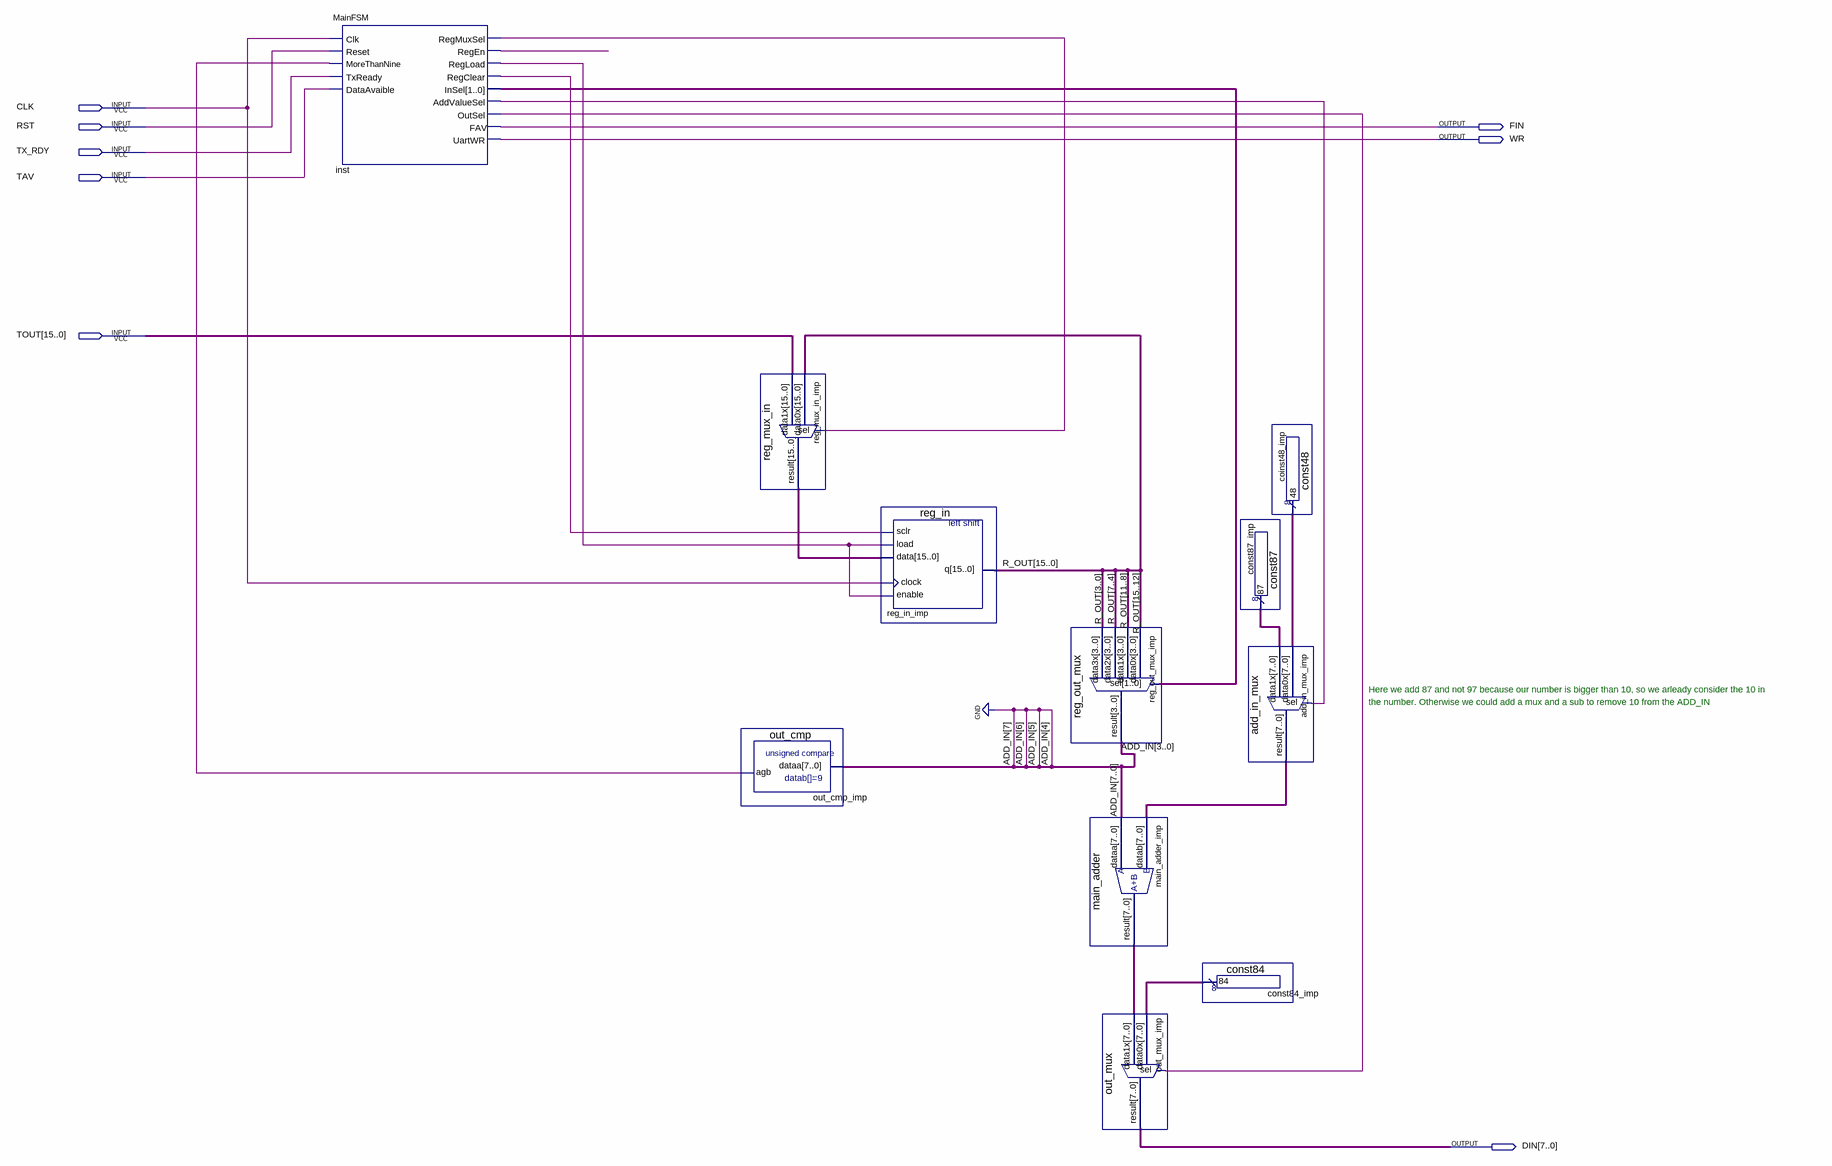
[diagram p0: schematic sheet]
// Quartus schematic ASCIIConverter.bdf as structural Verilog: 11 symbols, 8 pins
module ASCIIConverter (
  input  CLK,
  input  RST,
  input  TX_RDY,
  input  TAV,
  input  [15:0] TOUT,
  output FIN,
  output WR,
  output [7:0] DIN
);

  wire inst_addvaluesel, inst_outsel, inst_regclear, inst_regen, inst_regload, inst_regmuxsel,
       out_cmp_imp_agb;
  wire [1:0] inst_insel;
  wire [3:0] ADD_IN;
  wire [7:0] add_in_mux_imp_result, coinst48_imp_result, const84_imp_result, const87_imp_result,
       main_adder_imp_result;
  wire [15:0] R_OUT, reg_mux_in_imp_result;

  MainFSM inst (
    .Clk(CLK), .Reset(RST), .MoreThanNine(out_cmp_imp_agb), .TxReady(TX_RDY), .DataAvaible(TAV),
    .RegMuxSel(inst_regmuxsel), .RegEn(inst_regen), .RegLoad(inst_regload), .RegClear(inst_regclear),
    .InSel(inst_insel), .AddValueSel(inst_addvaluesel), .OutSel(inst_outsel), .FAV(FIN), .UartWR(WR));
  reg_mux_in reg_mux_in_imp (.data1x(TOUT), .data0x(R_OUT), .sel(inst_regmuxsel), .result(reg_mux_in_imp_result));
  out_cmp out_cmp_imp (.dataa({4'b0000, ADD_IN}), .agb(out_cmp_imp_agb));
  reg_in reg_in_imp (
    .sclr(inst_regclear), .load(inst_regload), .data(reg_mux_in_imp_result), .clock(CLK),
    .enable(inst_regload), .q(R_OUT));
  reg_out_mux reg_out_mux_imp (
    .data3x(R_OUT[3:0]), .data2x(R_OUT[7:4]), .data1x(R_OUT[11:8]), .data0x(R_OUT[15:12]), .sel(inst_insel),
    .result(ADD_IN));
  main_adder main_adder_imp (.dataa({4'b0000, ADD_IN}), .datab(add_in_mux_imp_result), .result(main_adder_imp_result));
  out_mux out_mux_imp (.data1x(main_adder_imp_result), .data0x(const84_imp_result), .sel(inst_outsel), .result(DIN));
  const84 const84_imp (.result(const84_imp_result));
  const87 const87_imp (.result(const87_imp_result));
  add_in_mux add_in_mux_imp (
    .data1x(const87_imp_result), .data0x(coinst48_imp_result), .sel(inst_addvaluesel),
    .result(add_in_mux_imp_result));
  const48 coinst48_imp (.result(coinst48_imp_result));

  // Notes on the sheet:
  //   Here we add 87 and not 97 because our number is bigger than 10, so we arleady consider the 10 in
  //   the number. Otherwise we could add a mux and a sub to remove 10 from the ADD_IN
endmodule
